# Altium schematic sheet Sheet07.SchDoc
size A4
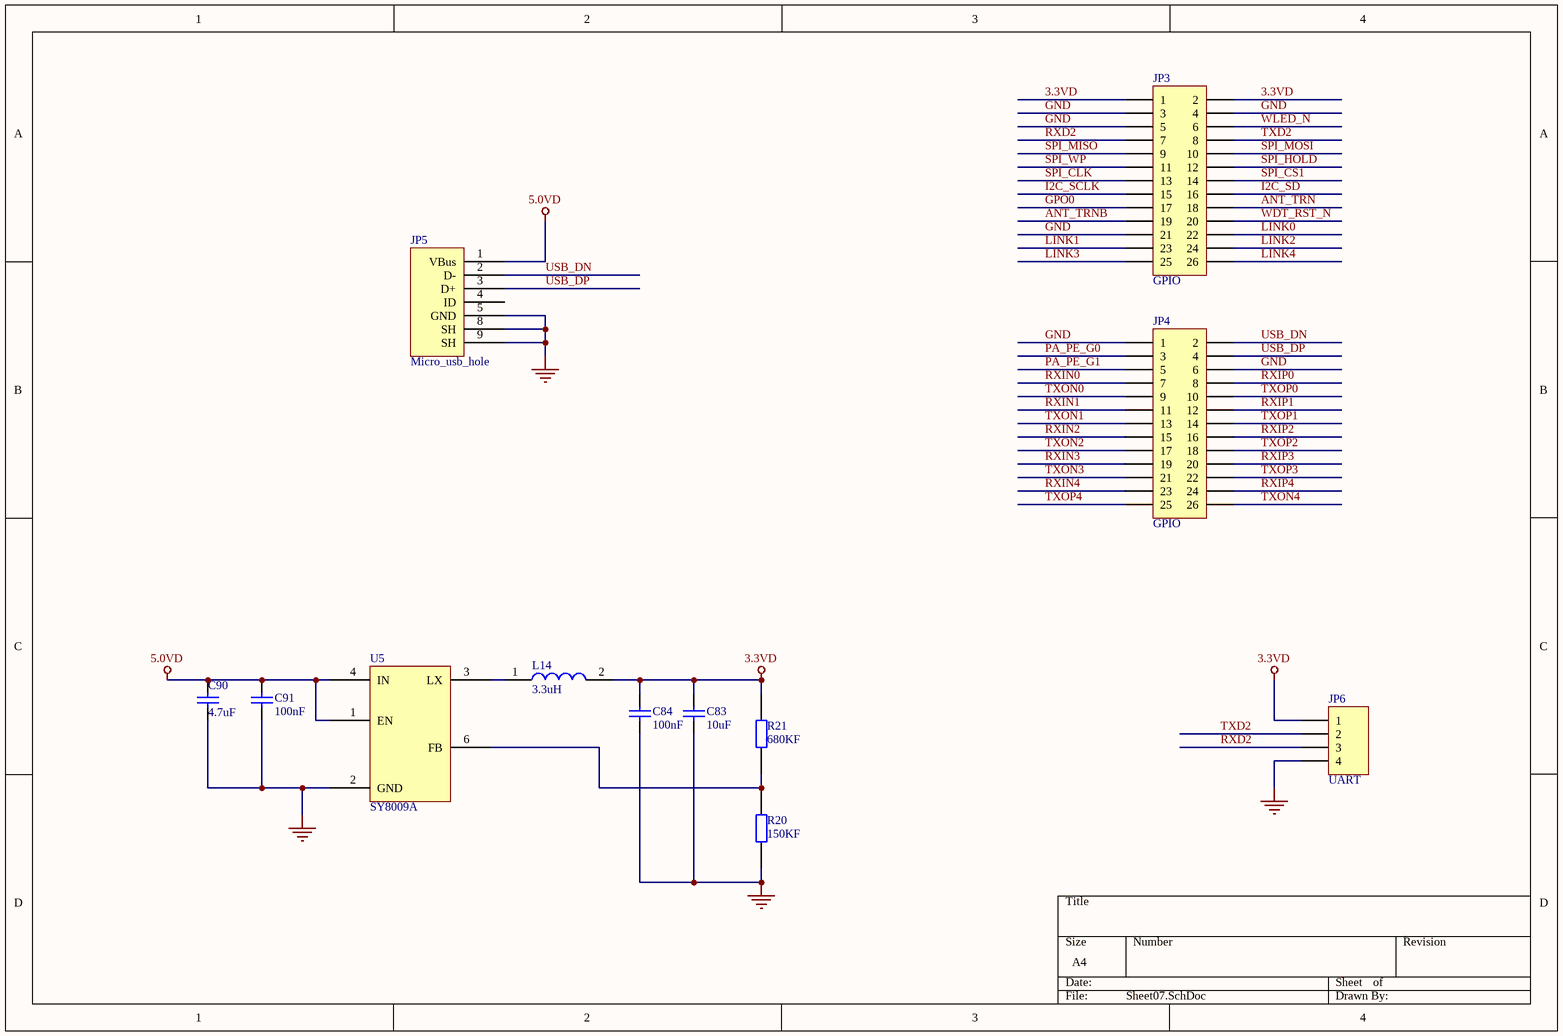
[diagram p0: Sheet07.SchDoc]

## Parts
C83  10uF  [R0805]
C84  100nF  [R0402]
C90  4.7uF  [R0603]
C91  100nF  [R0402]
JP3  GPIO  [HDR2X13]
JP4  GPIO  [HDR2X13]
JP5  Micro_usb_hole  [Miro_usb_hole]
JP6  UART  [HDR1X4]
L14  3.3uH  [LSMD3_8x3_8]
R20  150KF  [R0402]
R21  680KF  [R0402]
U5  SY8009A  [SOT23-6L]

## Nets
3.3VD: C83.1 C84.1 JP3.1 JP3.2 JP6.1 L14.2 R21.1
5.0VD: C90.2 C91.1 JP5.1(VBus) U5.1(EN) U5.4(IN)
GND: C83.2 C84.2 C90.1 C91.2 JP3.3 JP3.4 JP3.5 JP3.21 JP4.1 JP4.6 JP5.5(GND) JP5.8(SH) JP5.9(SH) JP6.4 R20.2 U5.2(GND)
ANT_TRN: JP3.18
ANT_TRNB: JP3.19
GPO0: JP3.17
I2C_SCLK: JP3.15
I2C_SD: JP3.16
LINK0: JP3.22
LINK1: JP3.23
LINK2: JP3.24
LINK3: JP3.25
LINK4: JP3.26
PA_PE_G0: JP4.3
PA_PE_G1: JP4.5
RXD2: JP3.7 JP6.3
RXIN0: JP4.7
RXIN1: JP4.11
RXIN2: JP4.15
RXIN3: JP4.19
RXIN4: JP4.23
RXIP0: JP4.8
RXIP1: JP4.12
RXIP2: JP4.16
RXIP3: JP4.20
RXIP4: JP4.24
SPI_CLK: JP3.13
SPI_CS1: JP3.14
SPI_HOLD: JP3.12
SPI_MISO: JP3.9
SPI_MOSI: JP3.10
SPI_WP: JP3.11
TXD2: JP3.8 JP6.2
TXON0: JP4.9
TXON1: JP4.13
TXON2: JP4.17
TXON3: JP4.21
TXON4: JP4.26
TXOP0: JP4.10
TXOP1: JP4.14
TXOP2: JP4.18
TXOP3: JP4.22
TXOP4: JP4.25
USB_DN: JP4.2 JP5.2(D-)
USB_DP: JP4.4 JP5.3(D+)
WDT_RST_N: JP3.20
WLED_N: JP3.6
NetL14_1: L14.1 U5.3(LX)
NetR20_1: R20.1 R21.2 U5.6(FB)

Not connected (* = marked no-connect by the designer): JP5 4(ID)

## Library data of the parts
C83 C84 C90 C91 = Cap Semi: 2pF, 50V, +/-0.25pF; Manufacturer: Generic Components; Class: Passive; SubClass: Capacitor; Value: 0.1uF; Published: 08/06/2000; Publisher: Altium Hobart Technology Centre
JP3 JP4 = Header 13X2: Header, 13-Pin, Dual row; LatestRevisionDate: 17-Jul-2002; LatestRevisionNote: Re-released for DXP Platform.; Publisher: Altium Limited
JP5 = micri_usb_hole
JP6 = Header 4: Header, 4-Pin; LatestRevisionDate: 17-Jul-2002; LatestRevisionNote: Re-released for DXP Platform.; Publisher: Altium Limited
L14 = INDUCTOR
R20 R21 = RES
U5 = SY8008C